# EAGLE design d1-mini-r2 (EAGLE 9.6.2)
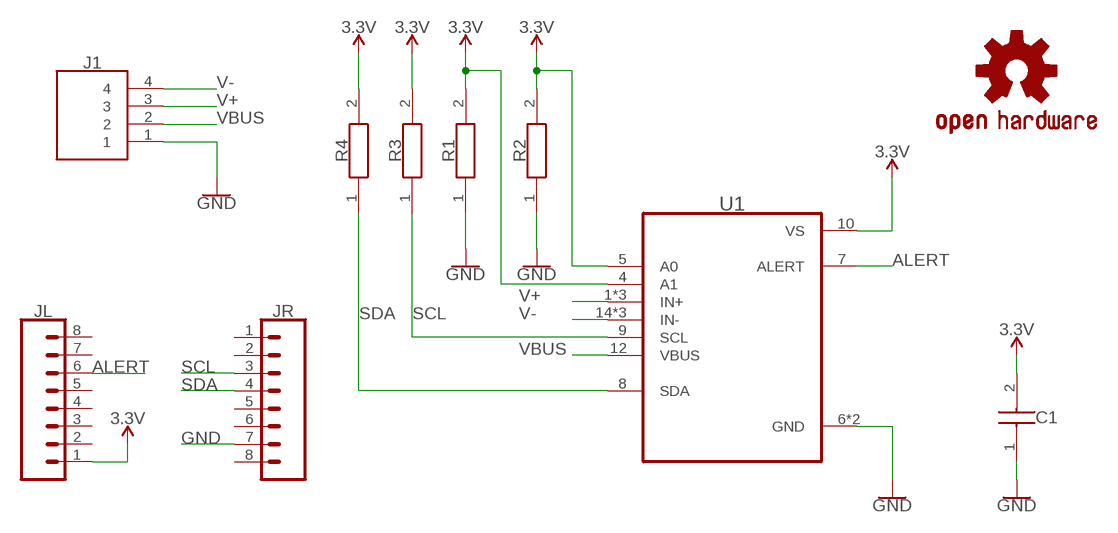
[diagram p0: schematic, sheet 1]

## Parts
C1  CL03A105MQ3CSNH  [CAPC1608X80N]
J1  282834-4  [2828344]
JL  CONN_08NO_SILK_FEMALE_PTH  [1X08_NO_SILK]
JR  CONN_08NO_SILK_FEMALE_PTH  [1X08_NO_SILK]
LOGO1  OSHW-LOGOS  [OSHW-LOGO-S]
R1  CRCW020110K0FNED  [RESC0603X28N]
R2  CRCW020110K0FNED  [RESC0603X28N]
R3  CRCW020110K0FNED  [RESC0603X28N]
R4  CRCW020110K0FNED  [RESC0603X28N]
U1  INA260AIPWR  [SOP65P640X120-16N]

## Nets
3.3V [current]: C1.2 JL.1 R1.2 R2.2 R3.2 R4.2 U1.4(A1) U1.5(A0) U1.10(VS)
ALERT [signal]: JL.6 U1.7(ALERT)
GND [current]: C1.1 J1.1 JR.7 R1.1 R2.1 U1.6(GND) U1.11(GND)
SCL [signal]: JR.3 R3.1 U1.9(SCL)
SDA [signal]: JR.4 R4.1 U1.8(SDA)
V+ [current]: J1.3 U1.1(IN+) U1.2(IN+) U1.3(IN+)
V- [current]: J1.4 U1.14(IN-) U1.15(IN-) U1.16(IN-)
VBUS [signal]: J1.2 U1.12(VBUS)
Unconnected: JL.2 JL.3 JL.4 JL.5 JL.7 JL.8 JR.1 JR.2 JR.5 JR.6 JR.8

## Library data of the parts
C1 = CL03A105MQ3CSNH:CL03A105MQ3CSNH: Multilayer Ceramic Capacitors MLCC - SMD/SMT 1uF+/-20% 6.3V X5R 0603 Source: Datasheet; DESCRIPTION: Multilayer Ceramic Capacitors MLCC - SMD/SMT 1uF+/-20% 6.3V X5R 0603; HEIGHT: 0.8mm; MANUFACTURER_NAME: Samsung Electro-Mechanics; MANUFACTURER_PART_NUMBER: CL03A105MQ3CSNH
J1 = 282834-4:282834-4: ic Source: Datasheet <https://www.te.com/commerce/DocumentDelivery/DDEController?Action=srchrtrv&DocNm=282834&DocType=Customer Drawing&DocLang=English&PartCntxt=282834-4&DocFormat=pdf>; DESCRIPTION: ic; HEIGHT: 10.3mm; MANUFACTURER_NAME: TE Connectivity; MANUFACTURER_PART_NUMBER: 282834-4; MOUSER_PART_NUMBER: 571-282834-4; MOUSER_PRICE-STOCK: https://www.mouser.co.uk/ProductDetail/TE-Connectivity/282834-4?qs=A%252Bip%252BNCYi6Pqom9P%2FaHyRQ%3D%3D
JL JR = SparkFun-Connectors:CONN_08: Multi connection point. Often used as Generic Header-pin footprint for 0.1 inch spaced/style header connections On any of the 0.1 inch spaced packages, you can populate with these: Break Away Headers - Straight <https://www.sparkfun.com/products/116> (PRT-00116) Break Away Male Headers - Right Angle <https://www.sparkfun.com/products/553> (PRT-00553) Female Headers <https://www.sparkfun.com/products/115> (PRT-00115) Break Away Headers - Machine Pin <https://www.sparkfun.com/products/117> (PRT-00117) Break Away Female Headers - Swiss Machine Pin <https://www.sparkfun.com/products/743> (PRT-00743) Arduino Stackable Header - 8 Pin <https://www.sparkfun.com/products/9279> (PRT-09279) For SCREWTERMINALS and SPRING TERMINALS visit here: Screw Terimnals on SparkFun.com <https://www.sparkfun.com/search/results?term=Screw+Terminals> (5mm/3.5mm/2.54mm spacing) This device is also useful as a general connection point to wire up your design to another part of your project. Our various solder wires solder well into these plated through hole pads. Hook-Up Wire - Assortment (Stranded, 22 AWG) <https://www.sparkfun.com/products/11375> (PRT-11375) Hook-Up Wire - Assortment (Solid Core, 22 AWG) <https://www.sparkfun.com/products/11367> (PRT-11367) View the entire wire category on our website here <https://www.sparkfun.com/categories/141> Special notes: Molex polarized connector foot print use with SKU : PRT-08231 with associated crimp pins and housings. 1MM SMD Version SKU: PRT-10208 NOTES ON THE VARIANTS LOCK and LOCK_LONGPADS... This footprint was designed to help hold the alignment of a through-hole component (i.e. 6-pin header) while soldering it into place. You may notice that each hole has been shifted either up or down by 0.005 of an inch from it's more standard position (which is a perfectly straight line). This slight alteration caused the pins (the squares in the middle) to touch the edges of the holes. Because they are alternating, it causes a "brace" to hold the component in place. 0.005 has proven to be the perfect amount of "off-center" position when using our standard breakaway headers. Although looks a little odd when you look at the bare footprint, once you have a header in there, the alteration is very hard to notice. Also,if you push a header all the way into place, it is covered up entirely on the bottom side.; PROD_ID: CONN-08438
LOGO1 = SparkFun-Aesthetics:OSHW-LOGO: Open-Source Hardware (OSHW) Logo This logo indicates the piece of hardware it is found on incorporates a OSHW license and/or adheres to the definition of open source hardware found here: http://freedomdefined.org/OSHW
R1-R4 = CRCW020110K0FNED:CRCW020110K0FNED: Thick Film Resistors - SMD 1/20watt 10Kohms 1% 200ppm Source: Datasheet <http://www.vishay.com/docs/20035/dcrcwe3.pdf>; DESCRIPTION: Thick Film Resistors - SMD 1/20watt 10Kohms 1% 200ppm; HEIGHT: 0.28mm; MANUFACTURER_NAME: Vishay; MANUFACTURER_PART_NUMBER: CRCW020110K0FNED; MOUSER_PART_NUMBER: 71-CRCW0201-10K; MOUSER_PRICE-STOCK: https://www.mouser.co.uk/ProductDetail/Vishay-Dale/CRCW020110K0FNED?qs=IQLUlsvFoXuh7T4rhkKYcQ%3D%3D
U1 = INA260AIPWR:INA260AIPWR: Check prices <https://pricing.snapeda.com/parts/INA260AIPWR/Texas%20Instruments/view-part?ref=eda>; AVAILABILITY: In Stock; DESCRIPTION: 36V, 16-bit, precision i2c output current/voltage/power monitor w/ int. shunt resistor 16-TSSOP -40 to 125; MF: Texas Instruments; MP: INA260AIPWR; PACKAGE: TSSOP-16 Texas Instruments; PRICE: None; PURCHASE-URL: https://pricing.snapeda.com/search/part/INA260AIPWR/?ref=eda

## Net classes
1 signal: width 0.152 mm, clearance 0.203 mm
2 current: width 0.203 mm, clearance 0.203 mm

## Board
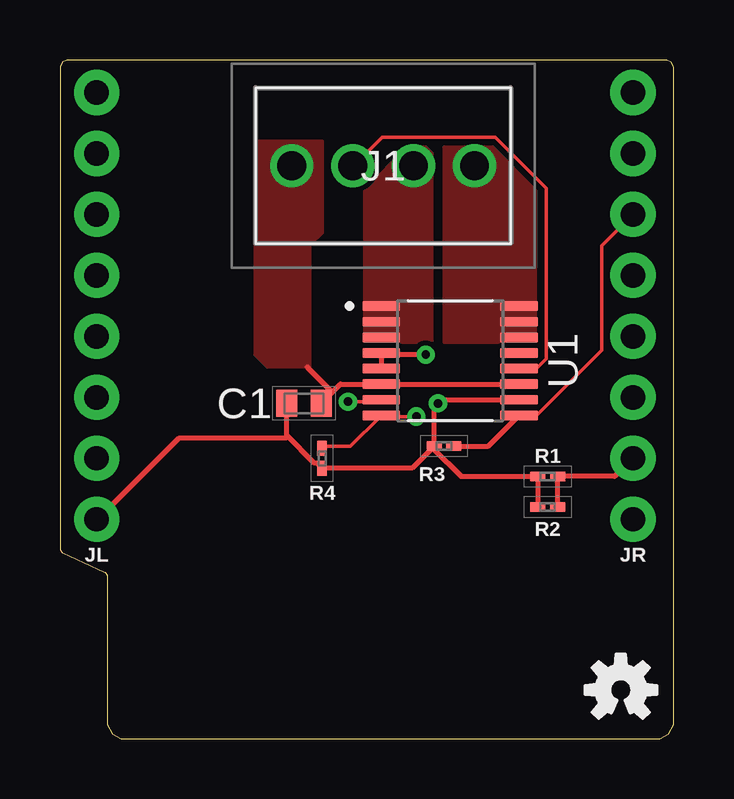
[diagram p1: board, top side]
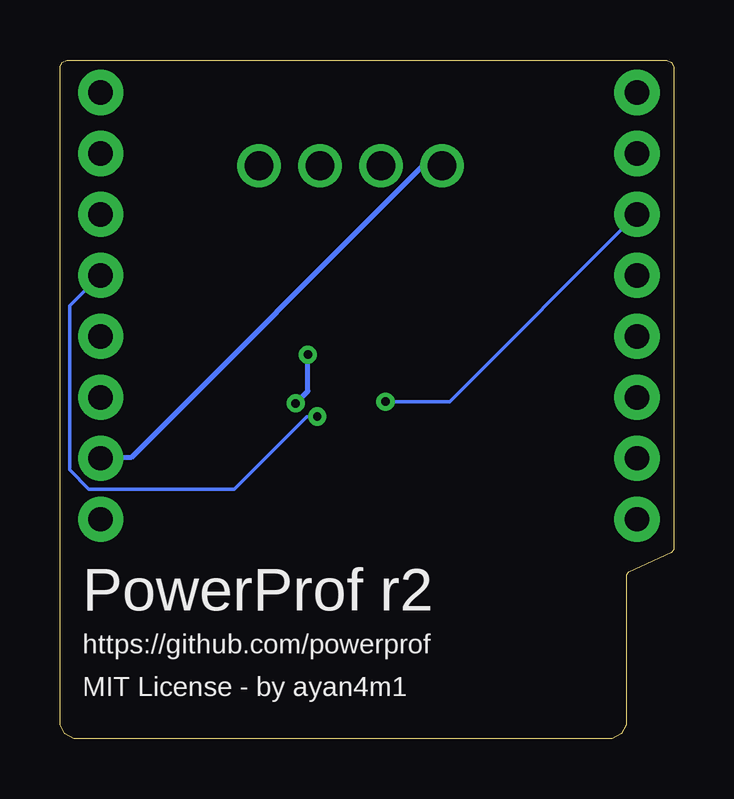
[diagram p2: board, bottom side, seen from below]

Size 25.57 x 28.28 mm. Coordinates in mm from the lower left corner, seen from the top.
Outline: 25.28,28.28 0.29,28.28 0.1,28.18 0,27.99 0,7.88 0.09,7.76 0.11,7.75 1.87,6.94 1.88,6.93 1.97,6.8 1.97,0.58 2.18,0.21 2.55,0 24.99,0 25.36,0.21 25.57,0.58 25.57,27.99 25.47,28.18 25.28,28.28
Copper layers (1*16): Top 0.035mm / dielectric 0.15mm / Bottom 0.035mm
Design rules "default *": minimum track width 6mil, minimum drill 0.35mm, track to track 8mil, track to pad 8mil, pad to pad 8mil, via to via 8mil, smd to smd 8mil, copper to edge 10mil, drill to drill 6mil, minimum pad ring 10mil, minimum via ring 8mil, stop-mask expansion 4mil, vias tented up to drill 0mil, thermal gap 10mil

### Footprints (pad centres in the part's own frame; a part is rotated, then mirrored left to right if it is on the bottom)
CAPC1608X80N = smd 0.87 x 1.12: 1 -0.72,0; 2 0.72,0
2828344 = drill 1.2 pad 1.8: 1 0,0; 2 2.54,0; 3 5.08,0; 4 7.62,0
1X08_NO_SILK = drill 1.016 pad 1.88: 1 0,0; 2 2.54,0; 3 5.08,0; 4 7.62,0; 5 10.16,0; 6 12.7,0; 7 15.24,0; 8 17.78,0
RESC0603X28N = smd 0.625 x 0.4: 1 -0.412,0; 2 0.412,0
SOP65P640X120-16N = smd 1.57 x 0.41: 1 -2.87,2.275; 2 -2.87,1.625; 3 -2.87,0.975; 4 -2.87,0.325; 5 -2.87,-0.325; 6 -2.87,-0.975; 7 -2.87,-1.625; 8 -2.87,-2.275; 9 2.87,-2.275; 10 2.87,-1.625; 11 2.87,-0.975; 12 2.87,-0.325; 13 2.87,0.325; 14 2.87,0.975; 15 2.87,1.625; 16 2.87,2.275

### Placement (x,y rotation side)
C1  10.16,13.97 180 top
J1  9.65,23.88 0 top
JL  1.52,9.14 90 top
JR  23.88,26.92 270 top
LOGO1  23.37,2.03 0 top
R1  20.32,10.92 180 top
R2  20.32,9.65 180 top
R3  16,12.19 180 top
R4  10.92,11.68 270 top
U1  16.26,15.75 0 top

### Tracks (layer width: path | path; a pad name or v marks a point on that pad's centre or on a via)
3.3V  (via drill 0.35)
  Top 0.203: R3.2 14.67,11.27 R4.2 10.71,11.48 10.6,11.48 9.44,12.63 | 9.44,12.63 C1.2 | R3.2 15.59,13.81 v15.75,13.97 15.9,14.12 U1.10 | v15.24,16 13.46,16 U1.4 U1.5 | R2.2 19.91,9.7 19.91,10.85 R1.2 19.82,10.94 16.71,10.94 15.56,12.09 R3.2 | 9.44,12.63 9.42,12.54 4.98,12.54 1.6,9.16 JL.1
  Bottom 0.203: v15.75,13.97 15.24,14.48 v15.24,16
ALERT  (via drill 0.35)
  Top 0.152: v12,14.05 13.34,14.05 U1.7
  Bottom 0.152: v12,14.05 9.34,14.05 1.6,21.78 JL.6
GND
  Top 0.203: U1.11 U1.6 11.68,14.77 C1.1 11.29,14.49 10.31,15.47 10.31,15.49 | R2.1 20.71,9.7 20.71,10.85 R1.1 20.8,10.94 23.11,10.94 23.82,11.65 JR.7
  Bottom 0.203: JR.7 23.82,11.73 22.58,11.73 10.49,23.82 9.69,23.82 9.69,23.91 J1.1
  pour Top (no thermals): 8.13,24.89 10.92,24.89 10.92,21.08 10.41,20.57 10.41,15.49 8.64,15.49 8.13,16
SCL
  Top 0.152: U1.9 19.2,13.51 19.91,13.51 22.58,16.18 22.58,20.54 23.82,21.78 JR.3
  Top 0.203: R3.1 17.84,12.19 U1.9
SDA  (via drill 0.35)
  Top 0.152: R4.1 10.94,12.18 12.09,12.18 13.34,13.42 U1.8 13.42,13.42 v14.85,13.42
  Bottom 0.152: v14.85,13.42 15.29,13.42 18.31,10.4 24.36,10.4 25.16,11.2 25.16,18.05 23.91,19.29 JR.4
V+
  pour Top (no thermals): 12.7,16.51 12.7,22.86 14.48,24.64 15.24,24.64 15.49,24.38 15.49,16.51
V-
  pour Top (no thermals): 19.81,16.51 19.81,22.86 18.03,24.64 16,24.64 16,16.51
VBUS
  Top 0.152: U1.12 19.2,15.47 19.91,15.47 20.27,15.82 20.27,22.94 18.14,25.07 13.42,25.07 12.27,23.91 J1.2

### Text on the board
bPlace: PowerProf r2 | https://github.com/powerprof | MIT License - by ayan4m1